# EAGLE schematic ScouseTom_CS_Shield_R3 (EAGLE 9.5.2)

## Sheet 1 of 5: Arduino
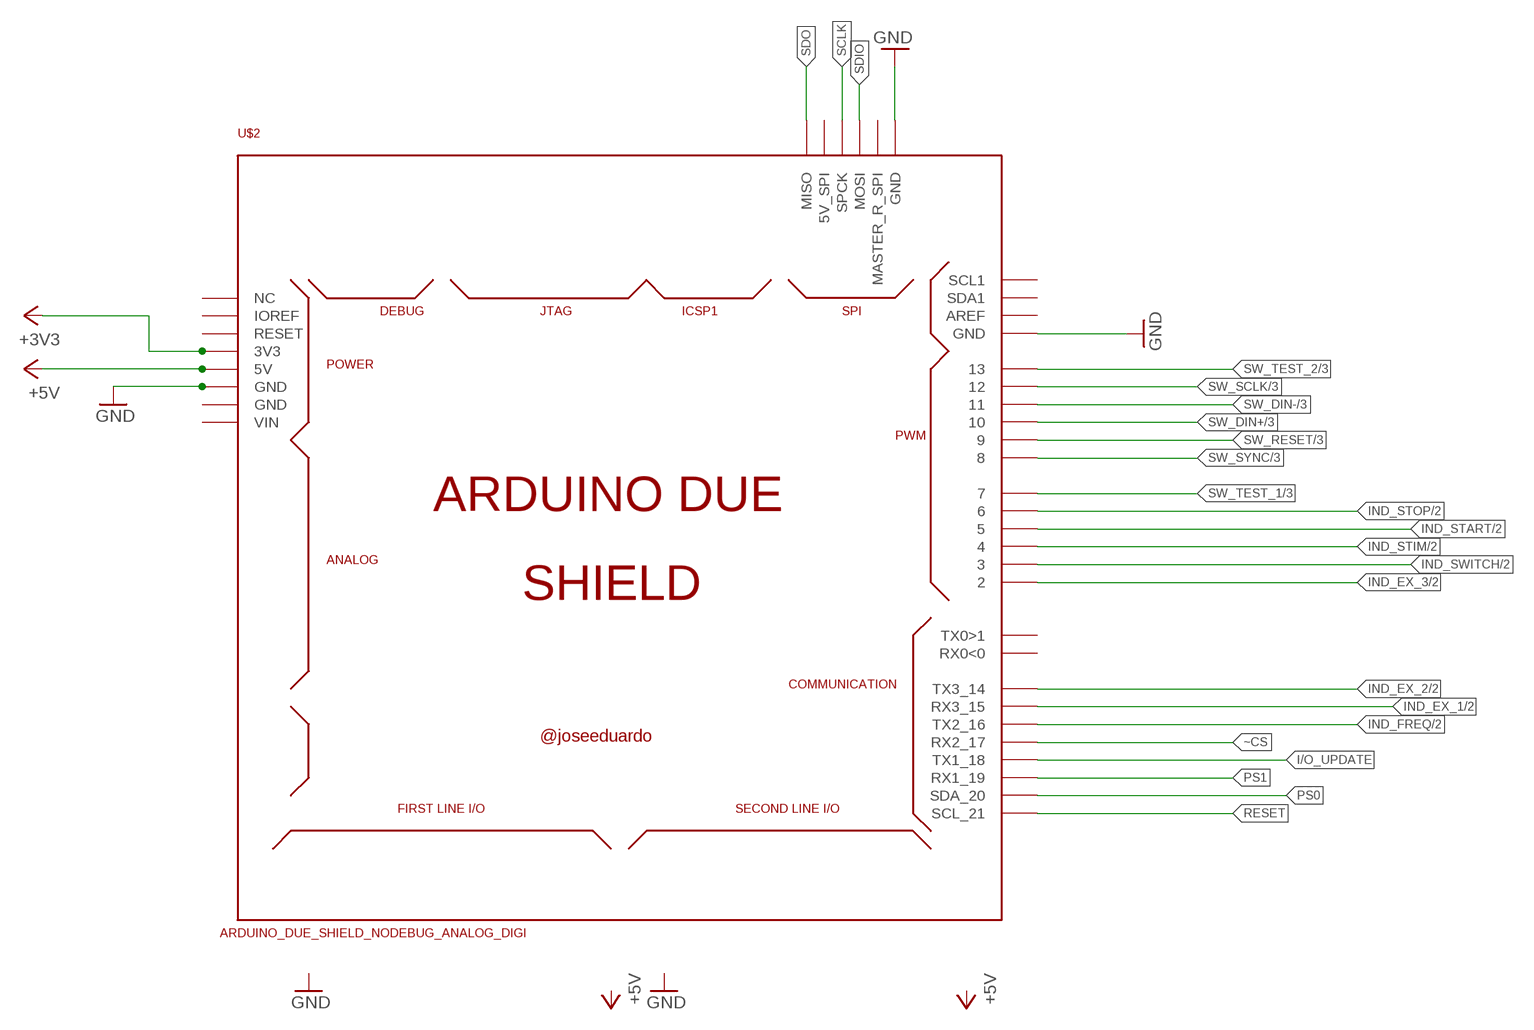
[diagram p0: schematic, sheet 1]

### Parts
U$2  ARDUINO_DUE_SHIELD_NODEBUG_ANALOG_DIGI  [ARDUINO_DUE_SHIELD_NODEBUG_ANALOG_DIG]

### Nets
+3V3: U$2.3V3 ; also sheet 4,5
+5V: U$2.5V0(5V) ; also sheet 2,3
GND: U$2.GND U$2.GND_4(GND) U$2.GND_5(GND) ; also sheet 2,3,4,5
I/O_UPDATE: U$2.18(TX1_18) ; also sheet 5
IND_EX_1: U$2.15(RX3_15) ; also sheet 2
IND_EX_2: U$2.14(TX3_14) ; also sheet 2
IND_EX_3: U$2.2 ; also sheet 2
IND_FREQ: U$2.16(TX2_16) ; also sheet 2
IND_START: U$2.5 ; also sheet 2
IND_STIM: U$2.4 ; also sheet 2
IND_STOP: U$2.6 ; also sheet 2
IND_SWITCH: U$2.3 ; also sheet 2
PS0: U$2.20(SDA_20) ; also sheet 5
PS1: U$2.19(RX1_19) ; also sheet 5
RESET: U$2.21(SCL_21) ; also sheet 5
SCLK: U$2.SPCK ; also sheet 4,5
SDIO: U$2.MOSI ; also sheet 4,5
SDO: U$2.MISO ; also sheet 4,5
SW_DIN+: U$2.10 ; also sheet 3
SW_DIN-: U$2.11 ; also sheet 3
SW_RESET: U$2.9 ; also sheet 3
SW_SCLK: U$2.12 ; also sheet 3
SW_SYNC: U$2.8 ; also sheet 3
SW_TEST_1: U$2.7 ; also sheet 3
SW_TEST_2: U$2.13 ; also sheet 3
~CS: U$2.17(RX2_17) ; also sheet 5
Unconnected: U$2.0(RX0<0) U$2.1(TX0>1) U$2.5V_2(5V_SPI) U$2.AREF U$2.GND_1(GND) U$2.IOREF U$2.MASTER_RESET_SPI(MASTER_R_SPI) U$2.NC_2(NC) U$2.RESET U$2.SCL1 U$2.SDA1 U$2.VIN

## Sheet 2 of 5: Indicators
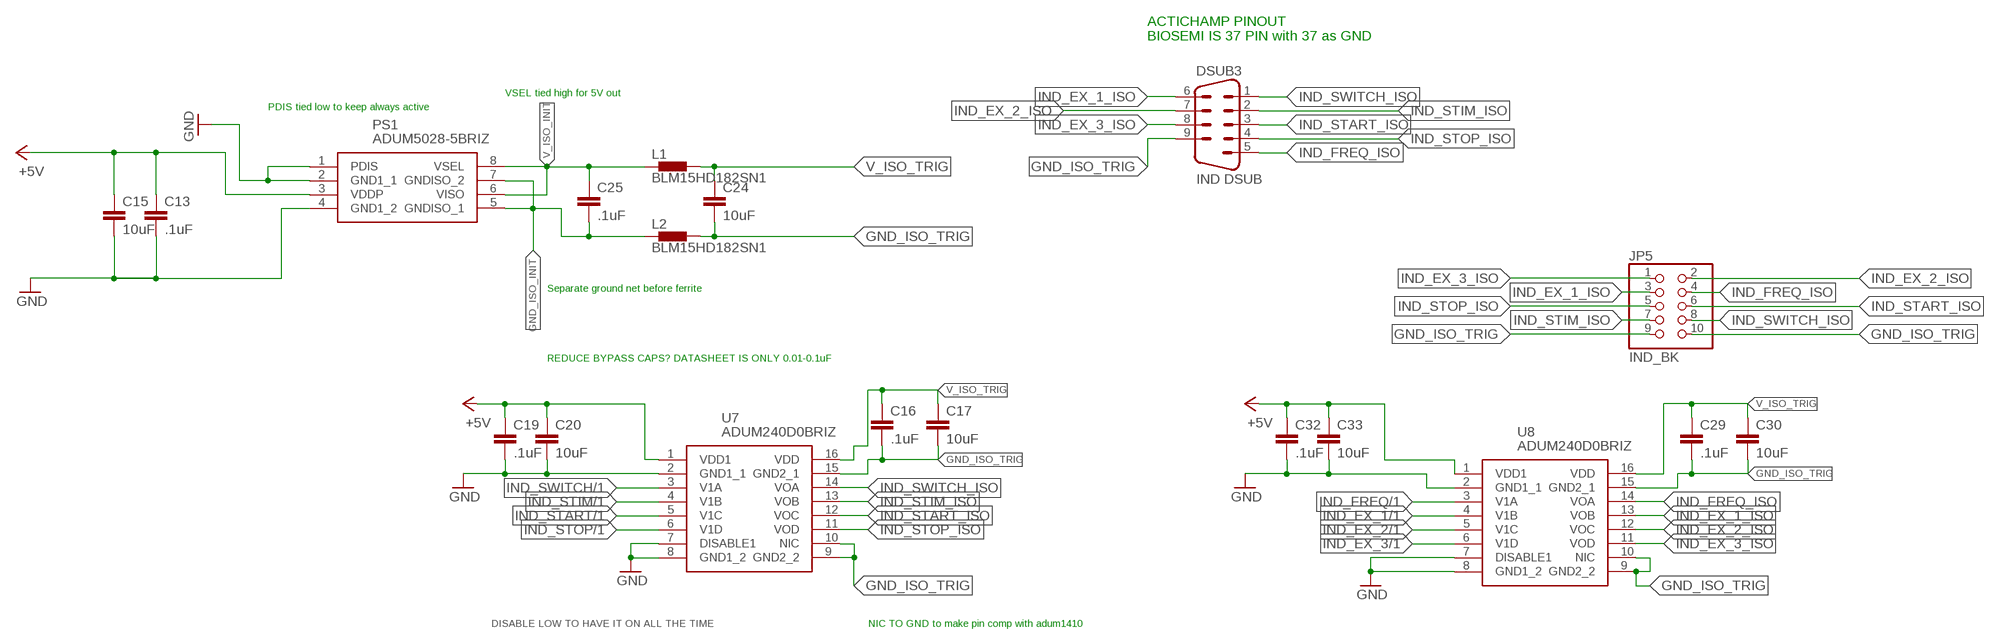
[diagram p1: schematic, sheet 2]

### Parts
C13  .1uF  C-EUC0603  [C0603]
C15  10uF  C-EUC0603  [C0603]
C16  .1uF  C-EUC0603  [C0603]
C17  10uF  C-EUC0603  [C0603]
C19  .1uF  C-EUC0603  [C0603]
C20  10uF  C-EUC0603  [C0603]
C24  10uF  C-EUC0603  [C0603]
C25  .1uF  C-EUC0603  [C0603]
C29  .1uF  C-EUC0603  [C0603]
C30  10uF  C-EUC0603  [C0603]
C32  .1uF  C-EUC0603  [C0603]
C33  10uF  C-EUC0603  [C0603]
DSUB3  IND DSUB  DSUB9RA  [DSUB9]
JP5  IND_BK  PINHD-2X5  [2X05]
L1  BLM15HD182SN1  [0402]
L2  BLM15HD182SN1  [0402]
PS1  ADUM5028-5BRIZ  [SOIC127P1031X265-8N]
U7  ADUM240D0BRIZ  [SOIC127P1032X265-16N]
U8  ADUM240D0BRIZ  [SOIC127P1032X265-16N]

### Nets
+5V: C13.1 C15.1 C19.1 C20.1 C32.1 C33.1 PS1.3(VDDP) U7.1(VDD1) U8.1(VDD1) ; also sheet 1,3
GND: C13.2 C15.2 C19.2 C20.2 C32.2 C33.2 PS1.1(PDIS) PS1.2(GND1_1) PS1.4(GND1_2) U7.2(GND1_1) U7.7(DISABLE1) U7.8(GND1_2) U8.2(GND1_1) U8.7(DISABLE1) U8.8(GND1_2) ; also sheet 1,3,4,5
GND_ISO_INIT: C25.2 L2.1 PS1.5(GNDISO_1) PS1.7(GNDISO_2)
GND_ISO_TRIG: C16.2 C17.2 C24.2 C29.2 C30.2 DSUB3.9 JP5.9 JP5.10 L2.2 U7.9(GND2_2) U7.10(NIC) U7.15(GND2_1) U8.9(GND2_2) U8.10(NIC) U8.15(GND2_1)
IND_EX_1: U8.4(V1B) ; also sheet 1
IND_EX_1_ISO: DSUB3.6 JP5.3 U8.13(VOB)
IND_EX_2: U8.5(V1C) ; also sheet 1
IND_EX_2_ISO: DSUB3.7 JP5.2 U8.12(VOC)
IND_EX_3: U8.6(V1D) ; also sheet 1
IND_EX_3_ISO: DSUB3.8 JP5.1 U8.11(VOD)
IND_FREQ: U8.3(V1A) ; also sheet 1
IND_FREQ_ISO: DSUB3.5 JP5.4 U8.14(VOA)
IND_START: U7.5(V1C) ; also sheet 1
IND_START_ISO: DSUB3.3 JP5.6 U7.12(VOC)
IND_STIM: U7.4(V1B) ; also sheet 1
IND_STIM_ISO: DSUB3.2 JP5.7 U7.13(VOB)
IND_STOP: U7.6(V1D) ; also sheet 1
IND_STOP_ISO: DSUB3.4 JP5.5 U7.11(VOD)
IND_SWITCH: U7.3(V1A) ; also sheet 1
IND_SWITCH_ISO: DSUB3.1 JP5.8 U7.14(VOA)
V_ISO_INIT: C25.1 L1.1 PS1.6(VISO) PS1.8(VSEL)
V_ISO_TRIG: C16.1 C17.1 C24.1 C29.1 C30.1 L1.2 U7.16(VDD) U8.16(VDD)

### Notes on the sheet
- ACTICHAMP PINOUT
  BIOSEMI IS 37 PIN with 37 as GND
- VSEL tied high for 5V out
- PDIS tied low to keep always active
- Separate ground net before ferrite
- REDUCE BYPASS CAPS? DATASHEET IS ONLY 0.01-0.1uF
- DISABLE LOW TO HAVE IT ON ALL THE TIME | NIC TO GND to make pin comp with adum1410

## Sheet 3 of 5: Switch
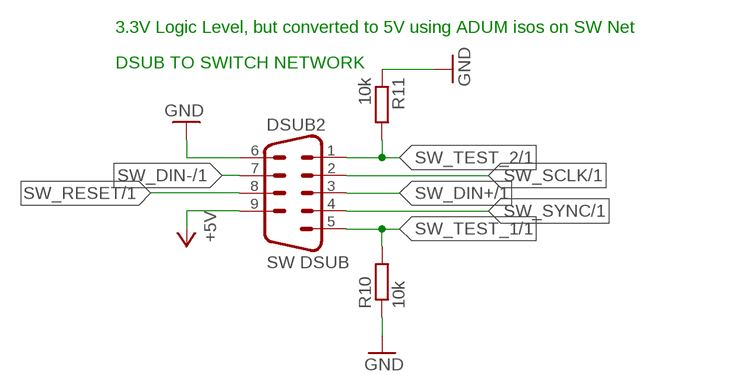
[diagram p2: schematic, sheet 3]

### Parts
DSUB2  SW DSUB  DSUB9RA  [DSUB9]
R10  10k  R-EU_R0805  [R0805]
R11  10k  R-EU_R0805  [R0805]

### Nets
+5V: DSUB2.9 ; also sheet 1,2
GND: DSUB2.6 R10.1 R11.1 ; also sheet 1,2,4,5
SW_DIN+: DSUB2.3 ; also sheet 1
SW_DIN-: DSUB2.7 ; also sheet 1
SW_RESET: DSUB2.8 ; also sheet 1
SW_SCLK: DSUB2.2 ; also sheet 1
SW_SYNC: DSUB2.4 ; also sheet 1
SW_TEST_1: DSUB2.5 R10.2 ; also sheet 1
SW_TEST_2: DSUB2.1 R11.2 ; also sheet 1

### Notes on the sheet
- 3.3V Logic Level, but converted to 5V using ADUM isos on SW Net
- DSUB TO SWITCH NETWORK

## Sheet 4 of 5: AD99554 Power and Clock
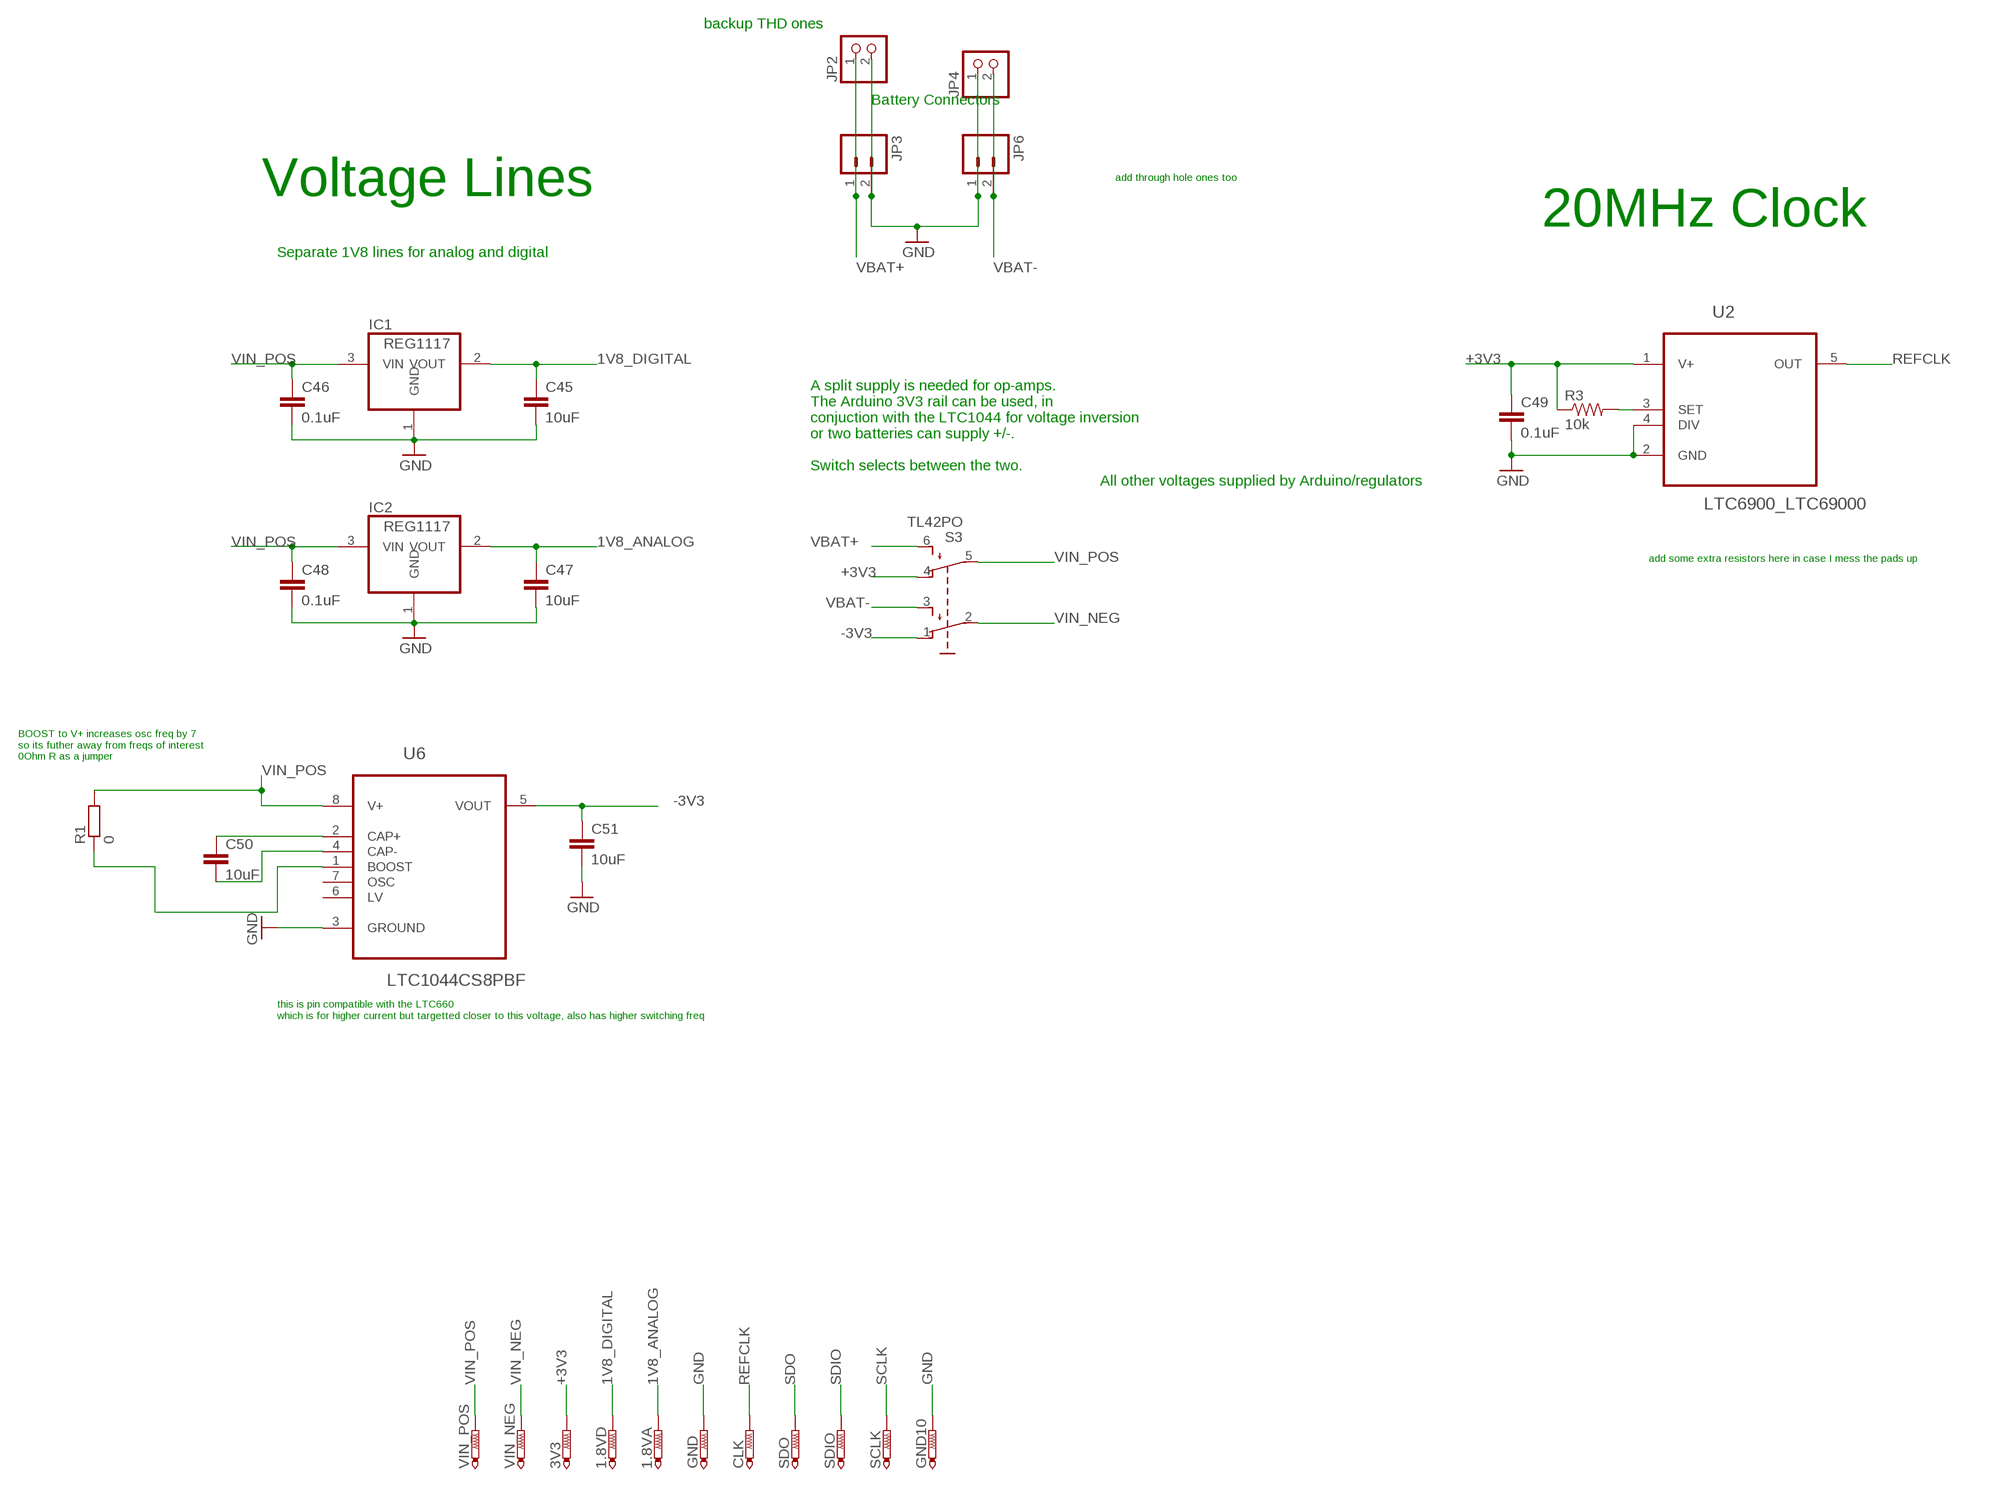
[diagram p3: schematic, sheet 4]

### Parts
1.8VA  PTR1PAD1-13  [P1-13]
1.8VD  PTR1PAD1-13  [P1-13]
3V3  PTR1PAD1-13  [P1-13]
C45  10uF  C-EUC0603  [C0603]
C46  0.1uF  C-EUC0603  [C0603]
C47  10uF  C-EUC0603  [C0603]
C48  0.1uF  C-EUC0603  [C0603]
C49  0.1uF  C-EUC0603  [C0603]
C50  10uF  C-EUC0603  [C0603]
C51  10uF  C-EUC0603  [C0603]
CLK  PTR1PAD1-13  [P1-13]
GND  PTR1PAD1-13  [P1-13]
GND10  PTR1PAD1-13  [P1-13]
IC1  REG1117  [SOT223]
IC2  REG1117  [SOT223]
JP2  PINHD-1X2  [1X02]
JP3  M02-JST-2MM-SMT  [JST-2-SMD]
JP4  PINHD-1X2  [1X02]
JP6  M02-JST-2MM-SMT  [JST-2-SMD]
R1  0  R-EU_R0805  [R0805]
R3  10k  R-US_R0805  [R0805]
S3  TL42PO  [TL4XPO]
SCLK  PTR1PAD1-13  [P1-13]
SDIO  PTR1PAD1-13  [P1-13]
SDO  PTR1PAD1-13  [P1-13]
U2  LTC6900_LTC69000  [LTC6900_SOT23-5L]
U6  LTC1044CS8PBF  [SOIC127P600X175-8N]
VIN_NEG  PTR1PAD1-13  [P1-13]
VIN_POS  PTR1PAD1-13  [P1-13]

### Nets
1V8_ANALOG: 1.8VA.TP C47.1 IC2.2(VOUT) ; also sheet 5
1V8_DIGITAL: 1.8VD.TP C45.1 IC1.2(VOUT) ; also sheet 5
+3V3: 3V3.TP C49.1 R3.1 S3.4(O1) U2.1(V+) ; also sheet 1,5
-3V3: C51.1 S3.1(O) U6.5(VOUT)
GND: C45.2 C46.2 C47.2 C48.2 C49.2 C51.2 GND10.TP GND.TP IC1.1(GND) IC2.1(GND) JP2.2 JP3.2 JP4.1 JP6.1 U2.2(GND) U2.4(DIV) U6.3(GROUND) ; also sheet 1,2,3,5
N$3: R1.1 U6.1(BOOST)
N$12: C50.1 U6.2(CAP+)
N$13: R3.2 U2.3(SET)
N$14: C50.2 U6.4(CAP-)
REFCLK: CLK.TP U2.5(OUT) ; also sheet 5
SCLK: SCLK.TP ; also sheet 1,5
SDIO: SDIO.TP ; also sheet 1,5
SDO: SDO.TP ; also sheet 1,5
VBAT+: JP2.1 JP3.1 S3.6(S1)
VBAT-: JP4.2 JP6.2 S3.3(S)
VIN_NEG: S3.2(P) VIN_NEG.TP ; also sheet 5
VIN_POS: C46.1 C48.1 IC1.3(VIN) IC2.3(VIN) R1.2 S3.5(P1) U6.8(V+) VIN_POS.TP ; also sheet 5
Unconnected: U6.6(LV) U6.7(OSC)

### Notes on the sheet
- backup THD ones
- Battery Connectors
- add through hole ones too
- Voltage Lines
- 20MHz Clock
- Separate 1V8 lines for analog and digital
- A split supply is needed for op-amps.
  The Arduino 3V3 rail can be used, in 
  conjuction with the LTC1044 for voltage inversion
  or two batteries can supply +/-.
  
  Switch selects between the two.
- All other voltages supplied by Arduino/regulators
- add some extra resistors here in case I mess the pads up
- BOOST to V+ increases osc freq by 7
  so its futher away from freqs of interest
  0Ohm R as a jumper
- this is pin compatible with the LTC660
  which is for higher current but targetted closer to this voltage, also has higher switching freq

## Sheet 5 of 5: DAC and HCP
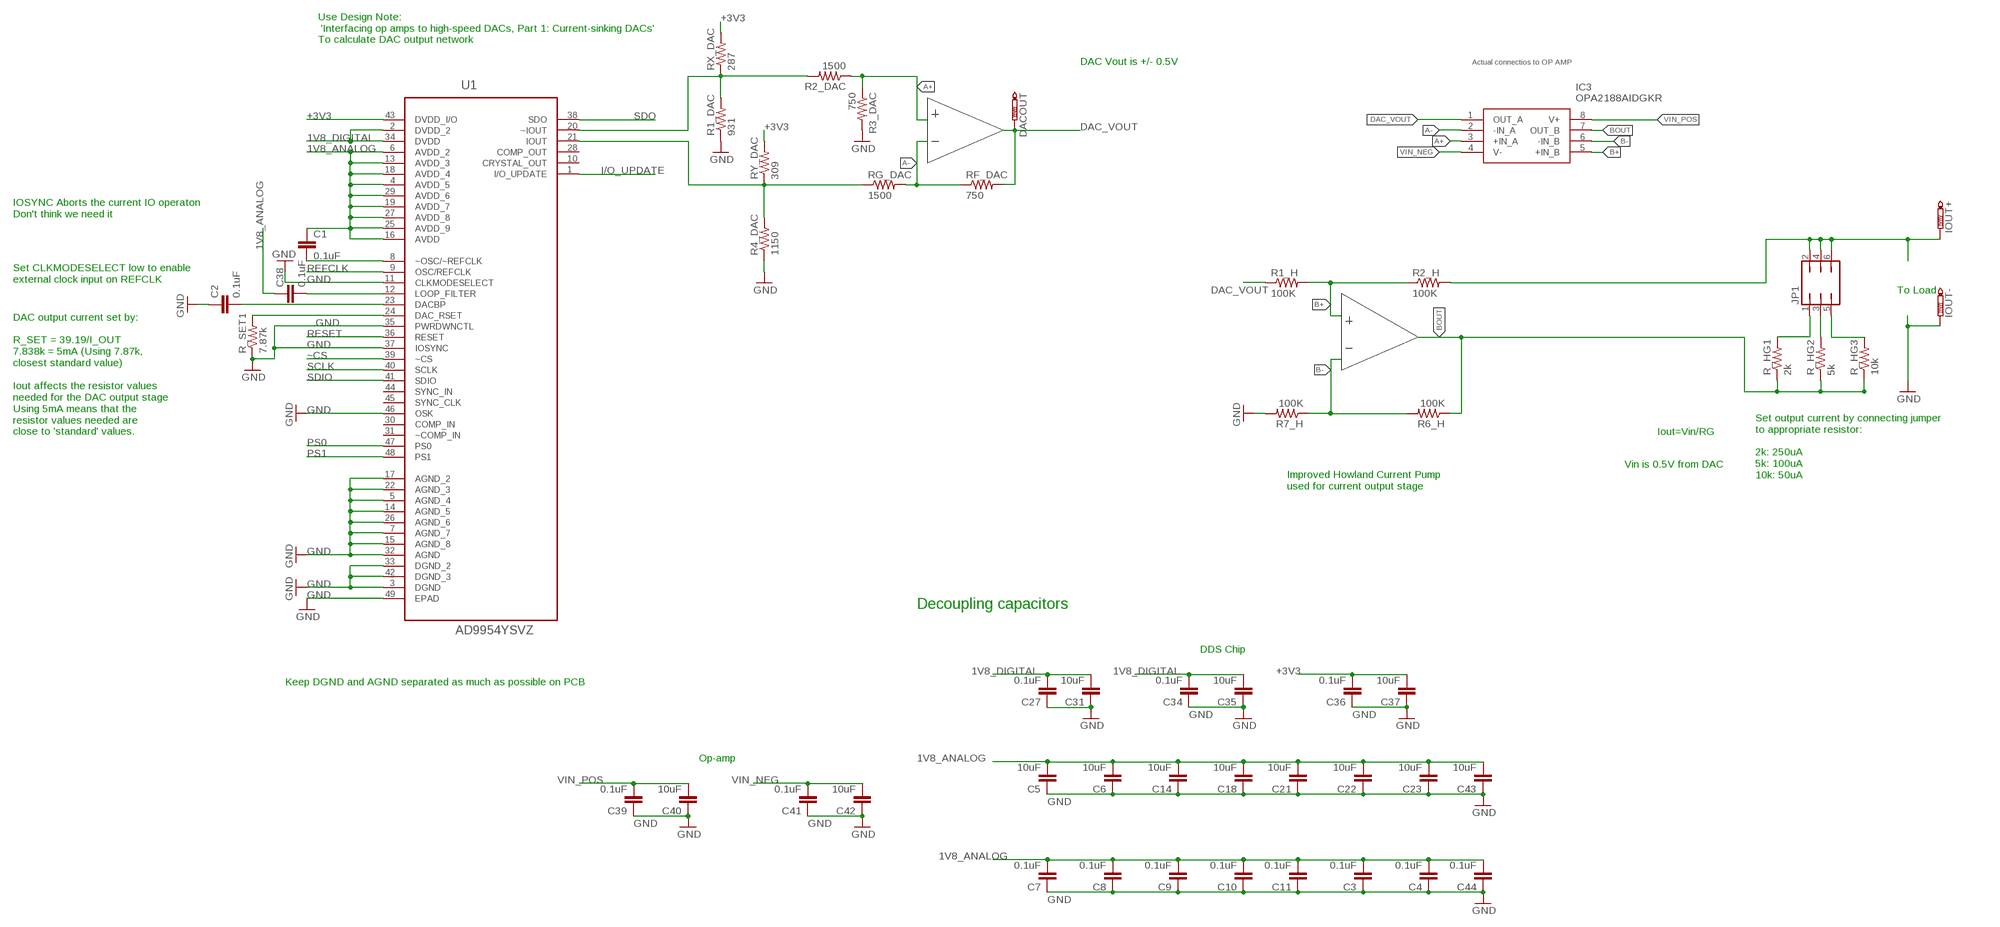
[diagram p4: schematic, sheet 5]

### Parts
C1  0.1uF  C-EUC0603  [C0603]
C2  0.1uF  C-EUC0603  [C0603]
C3  0.1uF  C-EUC0603  [C0603]
C4  0.1uF  C-EUC0603  [C0603]
C5  10uF  C-EUC0603  [C0603]
C6  10uF  C-EUC0603  [C0603]
C7  0.1uF  C-EUC0603  [C0603]
C8  0.1uF  C-EUC0603  [C0603]
C9  0.1uF  C-EUC0603  [C0603]
C10  0.1uF  C-EUC0603  [C0603]
C11  0.1uF  C-EUC0603  [C0603]
C14  10uF  C-EUC0603  [C0603]
C18  10uF  C-EUC0603  [C0603]
C21  10uF  C-EUC0603  [C0603]
C22  10uF  C-EUC0603  [C0603]
C23  10uF  C-EUC0603  [C0603]
C27  0.1uF  C-EUC0603  [C0603]
C31  10uF  C-EUC0603  [C0603]
C34  0.1uF  C-EUC0603  [C0603]
C35  10uF  C-EUC0603  [C0603]
C36  0.1uF  C-EUC0603  [C0603]
C37  10uF  C-EUC0603  [C0603]
C38  0.1uF  C-EUC0603  [C0603]
C39  0.1uF  C-EUC0603  [C0603]
C40  10uF  C-EUC0603  [C0603]
C41  0.1uF  C-EUC0603  [C0603]
C42  10uF  C-EUC0603  [C0603]
C43  10uF  C-EUC0603  [C0603]
C44  0.1uF  C-EUC0603  [C0603]
DACOUT  PTR1PAD1-13  [P1-13]
IC3  OPA2188AIDGKR  [SOP65P490X110-8N]
IOUT+  PTR1PAD1-13  [P1-13]
IOUT-  PTR1PAD1-13  [P1-13]
JP1  JP3Q  [JP3Q]
R1_DAC  931  R-US_R0805  [R0805]
R1_H  100K  R-US_R0805  [R0805]
R2_DAC  1500  R-US_R0805  [R0805]
R2_H  100K  R-US_R0805  [R0805]
R3_DAC  750  R-US_R0805  [R0805]
R4_DAC  1150  R-US_R0805  [R0805]
R6_H  100K  R-US_R0805  [R0805]
R7_H  100K  R-US_R0805  [R0805]
R_HG1  2k  R-US_R0805  [R0805]
R_HG2  5k  R-US_R0805  [R0805]
R_HG3  10k  R-US_R0805  [R0805]
R_SET1  7.87k  R-US_R0805  [R0805]
RF_DAC  750  R-US_R0805  [R0805]
RG_DAC  1500  R-US_R0805  [R0805]
RX_DAC  287  R-US_R0805  [R0805]
RY_DAC  309  R-US_R0805  [R0805]
U1  AD9954YSVZ  [QFP50P900X900X120-49N]

### Nets
1V8_ANALOG: C1.1 C3.2 C4.2 C5.2 C6.2 C7.2 C8.2 C9.2 C10.2 C11.2 C14.2 C18.2 C21.2 C22.2 C23.2 C38.1 C43.2 C44.2 U1.4(AVDD_5) U1.6(AVDD_2) U1.13(AVDD_3) U1.16(AVDD) U1.18(AVDD_4) U1.19(AVDD_7) U1.25(AVDD_9) U1.27(AVDD_8) U1.29(AVDD_6) ; also sheet 4
1V8_DIGITAL: C27.2 C31.2 C34.2 C35.2 U1.2(DVDD_2) U1.34(DVDD) ; also sheet 4
+3V3: C36.2 C37.2 RX_DAC.2 RY_DAC.2 U1.43(DVDD_I/O) ; also sheet 1,4
A+: IC3.3(+IN_A) R2_DAC.1 R3_DAC.1
A-: IC3.2(-IN_A) RF_DAC.1 RG_DAC.2
B+: IC3.5(+IN_B) R1_H.2 R2_H.1
B-: IC3.6(-IN_B) R6_H.2 R7_H.1
BOUT: IC3.7(OUT_B) R6_H.1 R_HG1.1 R_HG2.1 R_HG3.1
DAC_VOUT: DACOUT.TP IC3.1(OUT_A) R1_H.1 RF_DAC.2
GND: C2.1 C3.1 C4.1 C5.1 C6.1 C7.1 C8.1 C9.1 C10.1 C11.1 C14.1 C18.1 C21.1 C22.1 C23.1 C27.1 C31.1 C34.1 C35.1 C36.1 C37.1 C39.1 C40.1 C41.1 C42.1 C43.1 C44.1 IOUT-.TP R1_DAC.1 R3_DAC.2 R4_DAC.1 R7_H.2 R_SET1.1 U1.3(DGND) U1.5(AGND_4) U1.7(AGND_7) U1.11(CLKMODESELECT) U1.14(AGND_5) U1.15(AGND_8) U1.17(AGND_2) U1.22(AGND_3) U1.26(AGND_6) U1.32(AGND) U1.33(DGND_2) U1.35(PWRDWNCTL) U1.37(IOSYNC) U1.42(DGND_3) U1.46(OSK) U1.49(EPAD) ; also sheet 1,2,3,4
I/O_UPDATE: U1.1(I/O_UPDATE) ; also sheet 1
IOUT: R4_DAC.2 RG_DAC.1 RY_DAC.1 U1.21(IOUT)
N$1: C2.2 U1.23(DACBP)
N$2: C1.2 U1.8(~OSC/~REFCLK)
N$4: R_SET1.2 U1.24(DAC_RSET)
N$10: C38.2 U1.12(LOOP_FILTER)
N$11: IOUT+.TP JP1.2 JP1.4 JP1.6 R2_H.2
N$18: JP1.3 R_HG2.2
N$20: JP1.5 R_HG3.2
N$21: JP1.1 R_HG1.2
PS0: U1.47(PS0) ; also sheet 1
PS1: U1.48(PS1) ; also sheet 1
REFCLK: U1.9(OSC/REFCLK) ; also sheet 4
RESET: U1.36(RESET) ; also sheet 1
SCLK: U1.40(SCLK) ; also sheet 1,4
SDIO: U1.41(SDIO) ; also sheet 1,4
SDO: U1.38(SDO) ; also sheet 1,4
VIN_NEG: C41.2 C42.2 IC3.4(V-) ; also sheet 4
VIN_POS: C39.2 C40.2 IC3.8(V+) ; also sheet 4
~CS: U1.39(~CS) ; also sheet 1
~IOUT: R1_DAC.2 R2_DAC.2 RX_DAC.1 U1.20(~IOUT)
Unconnected: U1.10(CRYSTAL_OUT) U1.28(COMP_OUT) U1.30(COMP_IN) U1.31(~COMP_IN) U1.44(SYNC_IN) U1.45(SYNC_CLK)

### Notes on the sheet
- Use Design Note:
   'Interfacing op amps to high-speed DACs, Part 1: Current-sinking DACs' 
  To calculate DAC output network
- DAC Vout is +/- 0.5V | Actual connectios to OP AMP
- IOSYNC Aborts the current IO operaton
  Don't think we need it
- Set CLKMODESELECT low to enable
  external clock input on REFCLK
- To Load
- DAC output current set by:
  
  R_SET = 39.19/I_OUT
  7.838k = 5mA (Using 7.87k,
  closest standard value)
  
  Iout affects the resistor values
  needed for the DAC output stage
  Using 5mA means that the
  resistor values needed are
  close to 'standard' values.
- Iout=Vin/RG
- Vin is 0.5V from DAC
- Set output current by connecting jumper
  to appropriate resistor:
  
  2k: 250uA
  5k: 100uA
  10k: 50uA
- Improved Howland Current Pump
  used for current output stage
- Decoupling capacitors
- DDS Chip
- Keep DGND and AGND separated as much as possible on PCB
- Op-amp

## Library data of the parts
1.8VA 1.8VD 3V3 CLK DACOUT GND GND10 IOUT+ IOUT- SCLK SDIO SDO VIN_NEG VIN_POS = testpad:PTR1: TEST PIN
C1-C11 C13-C25 C27 C29-C51 = resistor:C-EU: CAPACITOR, European symbol
DSUB2 = DSUBJAMES:DSUB9RA
DSUB3 = ScouseTom_New:DSUB9RA
IC1 IC2 = burr-brown:REG1117: 800mA and 1A Low Dropout (LDO) Positive Regulator 1.8V, 2.5V, 2.85V, 3.3V, 5V, and Adj; MPN: REG1117; OC_FARNELL: 1097566; OC_NEWARK: 14P6981
IC3 = OPA2188AIDGKR:OPA2188AIDGKR: 0.03V/C, 6V Vos, Low Noise, Rail-to-Rail Output, 36V Zero-Drift Operational Amplifier Source: Datasheet <http://www.ti.com/lit/gpn/opa2188>; DESCRIPTION: 0.03V/C, 6V Vos, Low Noise, Rail-to-Rail Output, 36V Zero-Drift Operational Amplifier; HEIGHT: 1.1mm; MANUFACTURER_NAME: Texas Instruments; MANUFACTURER_PART_NUMBER: OPA2188AIDGKR
JP1 = jumper:JP3Q: JUMPER
JP2 JP4 = pinhead:PINHD-1X2: PIN HEADER
JP3 JP6 = SwitchBoard:M02: Header 2 Standard 2-pin 0.1" header. Use with straight break away headers (SKU : PRT-00116), right angle break away headers (PRT-00553), swiss pins (PRT-00743), machine pins (PRT-00117), and female headers (PRT-00115). Molex polarized connector foot print use with SKU : PRT-08233 with associated crimp pins and housings.
JP5 = pinhead:PINHD-2X5: PIN HEADER
L1 L2 = inductors:BLM15H: EMIFIL (R) Chip Ferrite Bead for GHz Noise Source: http://www.murata.com/ Ferrite Bead BLM15H.pdf
PS1 = ADUM5028-5BRIZ:ADUM5028-5BRIZ: Switching Voltage Regulators isoPower 3kV, Source: Datasheet <https://componentsearchengine.com/Datasheets/1/ADUM5028-5BRIZ.pdf>; DESCRIPTION: Switching Voltage Regulators isoPower 3kV,; HEIGHT: 2.65mm; MANUFACTURER_NAME: Analog Devices; MANUFACTURER_PART_NUMBER: ADUM5028-5BRIZ; MOUSER_PART_NUMBER: 584-ADUM5028-5BRIZ; MOUSER_PRICE-STOCK: https://www.mouser.com/Search/Refine.aspx?Keyword=584-ADUM5028-5BRIZ
R1 R10 R11 = resistor:R-EU_: RESISTOR, European symbol
R1_DAC R1_H R2_DAC R2_H R3 R3_DAC R4_DAC R6_H R7_H R_HG1-R_HG3 R_SET1 RF_DAC RG_DAC RX_DAC RY_DAC = adafruit:R-US_: RESISTOR, American symbol
S3 = switch:TL42PO: TINY SWITCH ON - MOM Source: http://www2.produktinfo.conrad.com/datenblaetter/700000-724999/705152-da-01-de-Subminiaturschalter_TL_36YO.pdf
U1 = AD9954:AD9954YSVZ: Direct Digital Synthesizer; MPN: AD9954YSVZ; OC_FARNELL: 1581969; OC_NEWARK: 19M8953; PACKAGE: TQFP-48; SUPPLIER: ANALOG DEVICES
U2 = Low.Noise.Current.Source:LTC6900_LTC69000: Low Power, 1kHz to 20MHz Resistor Set SOT-23 Oscillator
U6 = LTC_By_element14_Batch_1:LTC1044CS8PBF: Switched Capacitor Voltage Converter; MPN: LTC1044CS8#PBF; OC_FARNELL: 1663593; OC_NEWARK: 55M8900; PACKAGE: SOIC-8; SUPPLIER: Linear Technology
U7 U8 = ADUM240D0BRIZ:ADUM240D0BRIZ: Digital Isolator CMOS 4-CH 150Mbps 16-Pin SOIC W Tube Source: Datasheet <https://www.arrow.com/en/products/adum240d0briz/analog-devices>; DESCRIPTION: Digital Isolator CMOS 4-CH 150Mbps 16-Pin SOIC W Tube; HEIGHT: 2.65mm; MANUFACTURER_NAME: Analog Devices; MANUFACTURER_PART_NUMBER: ADUM240D0BRIZ
U$2 = arduino_due_shield:ARDUINO_DUE_SHIELD_NODEBUG_ANALOG_DIGI